# EasyEDA Pro project Battery_18650&3.eprj

# Schematic Schematic1_1
Board Name: Battery; Create Date: 2025-06-20; Page Name: P1; Project Name: Battery_18650&3; Schematic Name: Schematic1_1; Update Date: 2025-06-25; Company: 嘉立创EDA; Page Size: A4; Version: V1.0
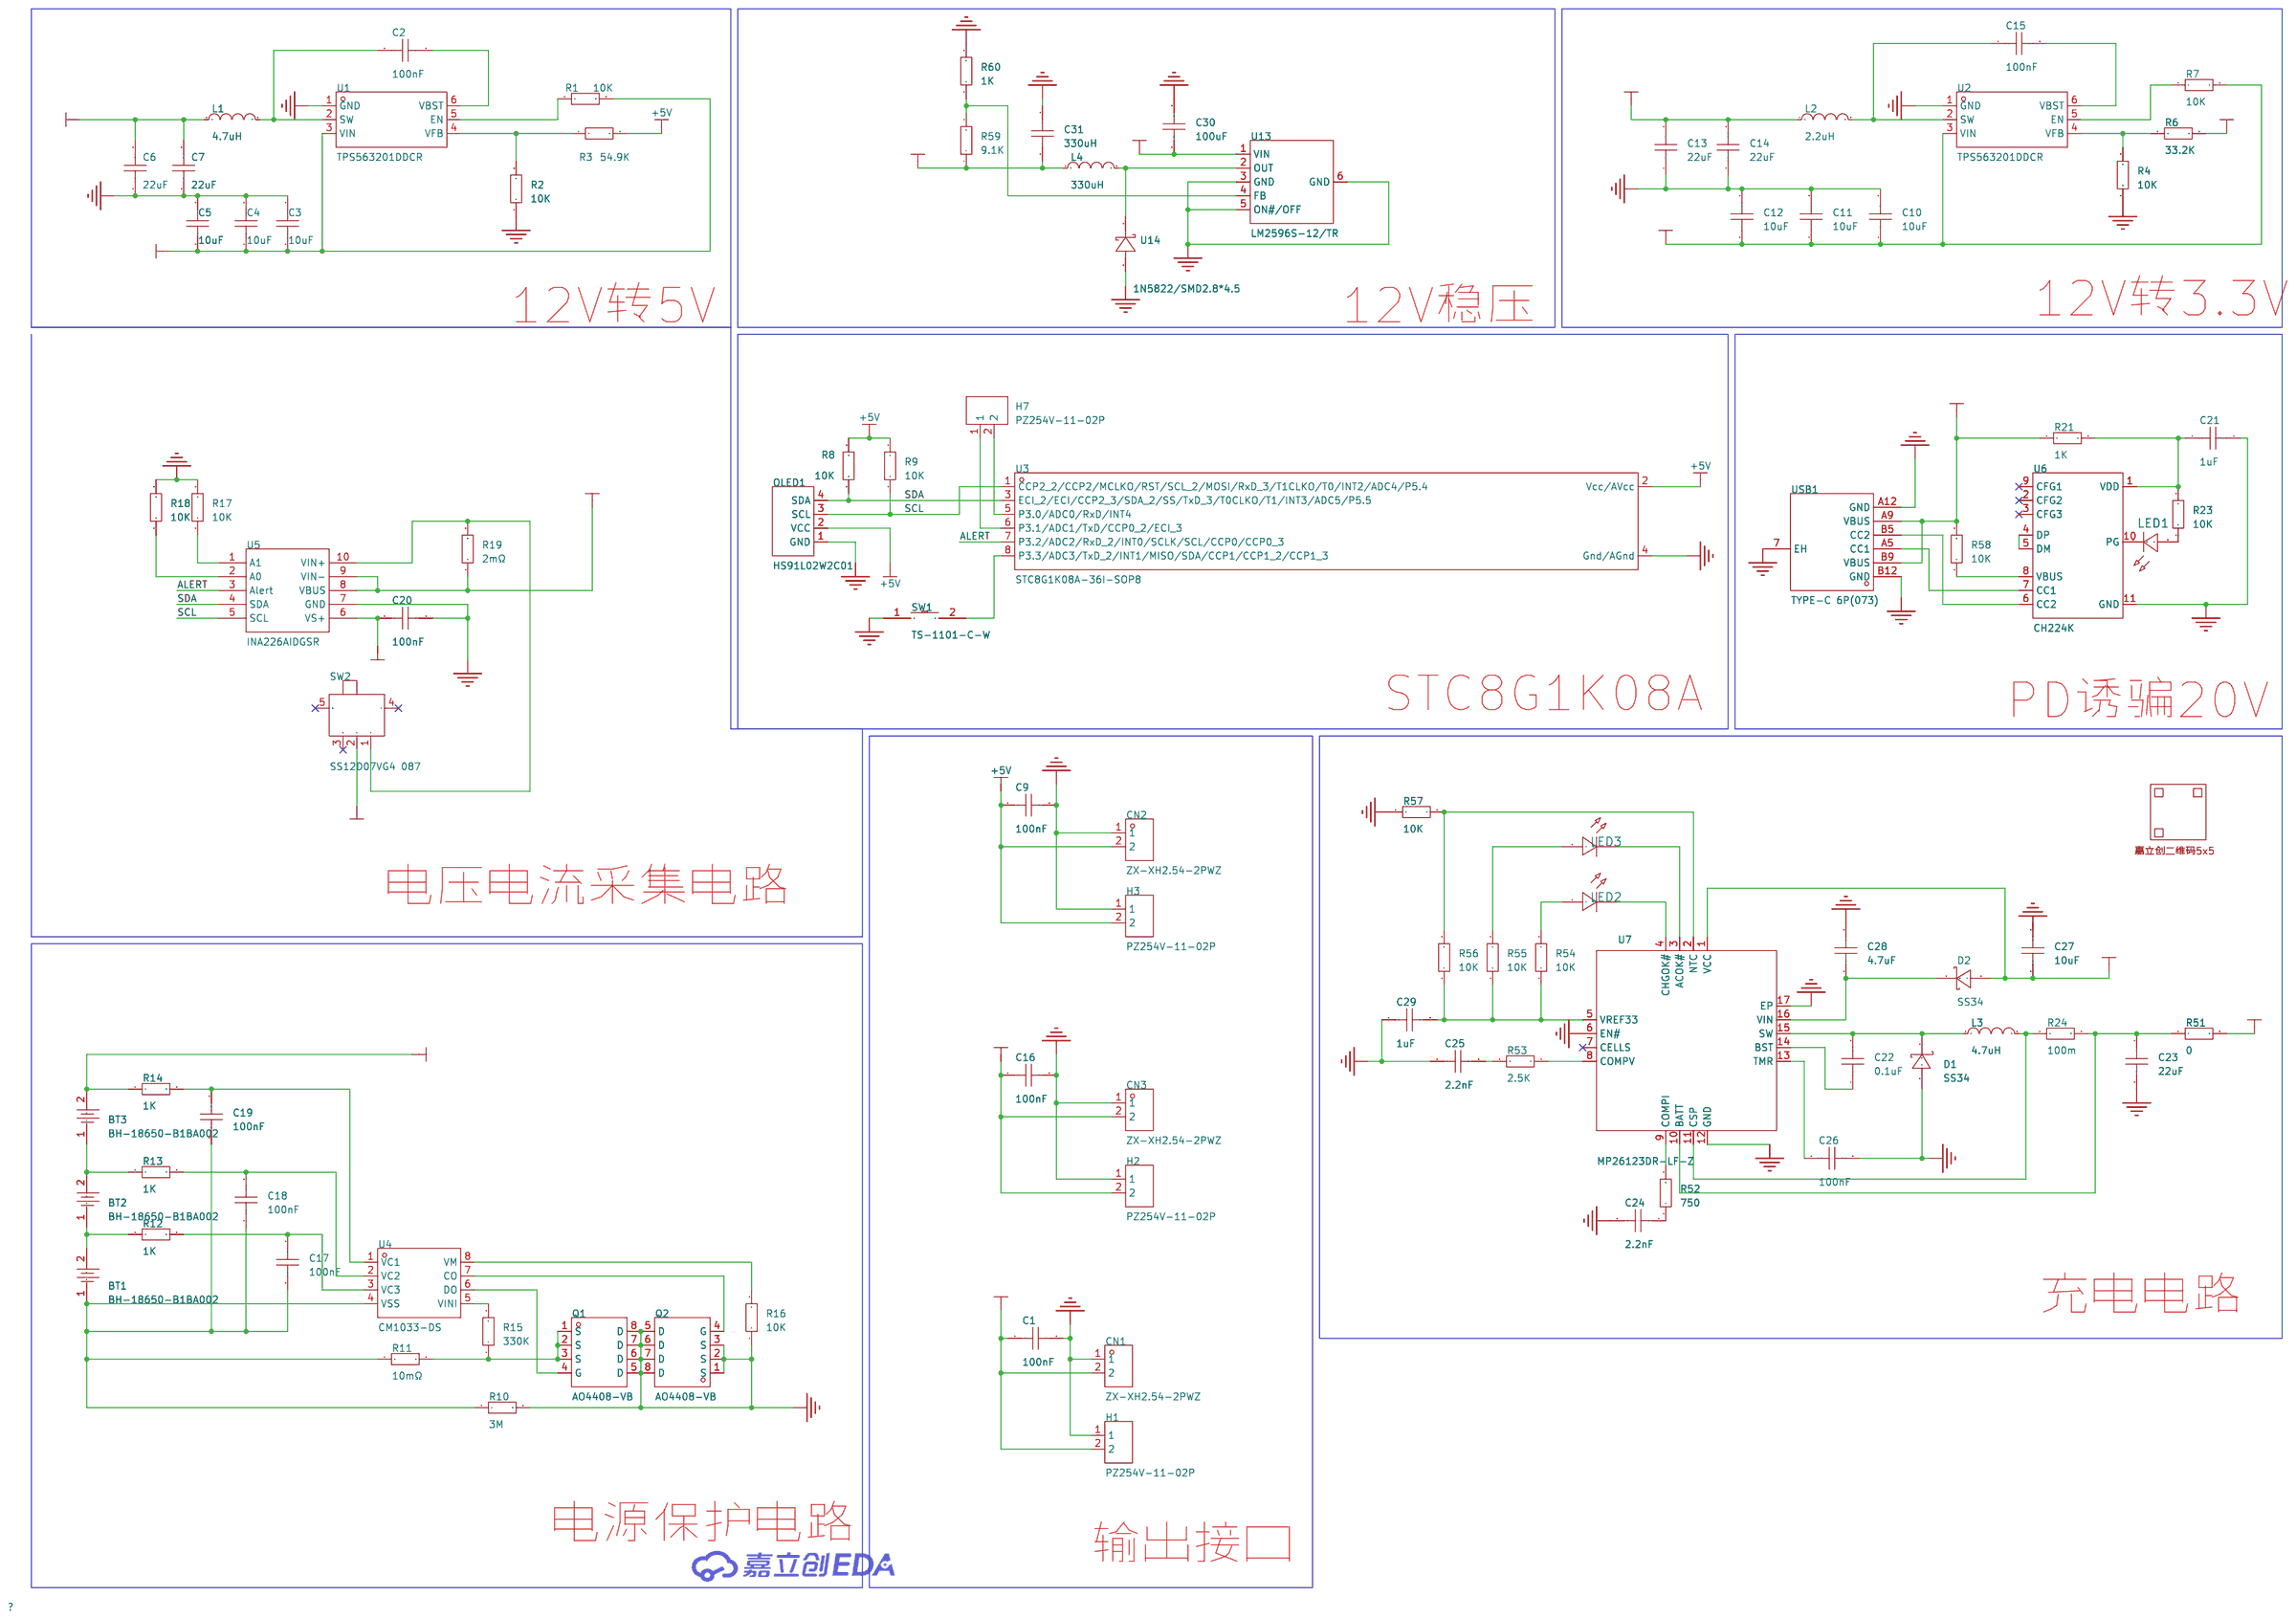
[diagram p0: schematic sheet]

## Parts
BT1  BH-18650-B1BA002  [BATTERY-SMD_18650-1S-L77.1-W20.7-1]
BT2  BH-18650-B1BA002  [BATTERY-SMD_18650-1S-L77.1-W20.7-1]
BT3  BH-18650-B1BA002  [BATTERY-SMD_18650-1S-L77.1-W20.7-1]
C1  100nF  [C0603]
C2  100nF  [C0603]
C3  10uF  [C0603]
C4  10uF  [C0603]
C5  10uF  [C0603]
C6  22uF  [C0603]
C7  22uF  [C0603]
C9  100nF  [C0603]
C10  10uF  [C0603]
C11  10uF  [C0603]
C12  10uF  [C0603]
C13  22uF  [C0603]
C14  22uF  [C0603]
C15  100nF  [C0603]
C16  100nF  [C0603]
C17  100nF  [C0603]
C18  100nF  [C0603]
C19  100nF  [C0603]
C20  100nF  [C0603]
C21  1uF  [C0603]
C22  0.1uF  [C0603]
C23  22uF  [C0603]
C24  2.2nF  [C0603]
C25  2.2nF  [C0603]
C26  100nF  [C0603]
C27  10uF  [C0603]
C28  4.7uF  [C0603]
C29  1uF  [C0603]
C30  100uF  [C0603]
C31  330uH  [C0603]
CN1  ZX-XH2.54-2PWZ  [CONN-TH_2P-P2.50_ZX-XH2.54-2PWZ]
CN2  ZX-XH2.54-2PWZ  [CONN-TH_2P-P2.50_ZX-XH2.54-2PWZ]
CN3  ZX-XH2.54-2PWZ  [CONN-TH_2P-P2.50_ZX-XH2.54-2PWZ]
D1  SS34  [SMC_L6.9-W5.9-LS7.9-RD]
D2  SS34  [SMC_L6.9-W5.9-LS7.9-RD]
H1  PZ254V-11-02P  [HDR-TH_2P-P2.54-V-M]
H2  PZ254V-11-02P  [HDR-TH_2P-P2.54-V-M]
H3  PZ254V-11-02P  [HDR-TH_2P-P2.54-V-M]
H7  PZ254V-11-02P  [HDR-TH_2P-P2.54-V-M]
L1  4.7uH  [IND-SMD_L4.0-W4.0_FNR40XXS]
L2  2.2uH  [IND-SMD_L4.0-W4.0_FNR40XXS]
L3  4.7uH  [IND-SMD_L11.5-W10.0_FXL1040]
L4  330uH  [IND-SMD_L11.5-W10.0_FXL1040]
LED1  -  [LED_0603]
LED2  -  [LED_0603]
LED3  -  [LED_0603]
OLED1  HS91L02W2C01  [OLED-TH_L38.0-W12.0_HS91L02W2C01]
Q1  AO4408-VB  [SO-8_L4.9-W3.9-P1.27-LS5.9-BL]
Q2  AO4408-VB  [SO-8_L4.9-W3.9-P1.27-LS5.9-BL]
R1  10K  [R0603]
R2  10K  [R0603]
R3  54.9K  [R0603]
R4  10K  [R0603]
R6  33.2K  [R0603]
R7  10K  [R0603]
R8  10K  [R0603]
R9  10K  [R0603]
R10  3M  [R0603]
R11  10mΩ  [R0603]
R12  1K  [R0603]
R13  1K  [R0603]
R14  1K  [R0603]
R15  330K  [R0603]
R16  10K  [R0603]
R17  10K  [R0603]
R18  10K  [R0603]
R19  2mΩ  [R0603]
R21  1K  [R0603]
R23  10K  [R0603]
R24  100m  [R0603]
R51  0  [R0603]
R52  750  [R0603]
R53  2.5K  [R0603]
R54  10K  [R0603]
R55  10K  [R0603]
R56  10K  [R0603]
R57  10K  [R0603]
R58  10K  [R0603]
R59  9.1K  [R0603]
R60  1K  [R0603]
SW1  TS-1101-C-W  [SW-SMD_L6.0-W3.3-LS8.0]
SW2  SS12D07VG4 087  [SW-TH_SS12D07VG4]
U1  TPS563201DDCR  [SOT-23-6_L2.9-W1.6-P0.95-LS2.8-BR]
U2  TPS563201DDCR  [SOT-23-6_L2.9-W1.6-P0.95-LS2.8-BR]
U3  STC8G1K08A-36I-SOP8  [SOP-8_L5.0-W4.0-P1.27-LS6.0-BL]
U4  CM1033-DS  [SOP-8_L5.0-W4.0-P1.27-LS6.2-BL]
U5  INA226AIDGSR  [MSOP-10_L3.0-W3.0-P0.50-LS5.0-BL]
U6  CH224K  [ESSOP-10_L4.9-W3.9-P1.0-LS6.0-TL-EP]
U7  MP26123DR-LF-Z  [QFN-16_L4.0-W4.0-P0.65-BL-EP2.2]
U13  LM2596S-12/TR  [TO-263-5_L10.6-W9.6-P1.70-LS15.9-BR]
U14  1N5822/SMD2.8*4.5  [DO-214AC_L4.3-W2.7-LS5.0-RD]
U24  -  [JLC-QRCODE-5x5]
USB1  TYPE-C 6P(073)  [TYPE-C-SMD_TYPE-C-6P_5]

## Library data of the parts
BT1-BT3 = BH-18650-B1BA002: 连接器类型:电池盒;适用电池规格:18650;; LCSC Part Name: 电池盒 适用电池:18650; Supplier Part: C2988620; Manufacturer: MYOUNG(美阳); Supplier Footprint: SMD; JLCPCB Part Class: 扩展库; Datasheet: https://atta.szlcsc.com/upload/public/pdf/source/20220402/870DB99AB50CA0DF8D51CF7C86A51FAB.pdf; Supplier: LCSC; Connector Type: 电池盒; Battery Type: 18650
C1-C7 C9-C31 = CAP_0603: Supplier Footprint: 0603
CN1-CN3 = ZX-XH2.54-2PWZ: 插针结构:1x2P;间距:2.5mm;安装方式:弯插;参考系列:XH;总PIN数:2P;排数:1;每排PIN数:2;行距:-;额定电流:3A;触头材质:黄铜;触头镀层:锡;工作温度范围:-25℃~+85℃;; LCSC Part Name: 1x2P 间距:2.5mm 弯插 系列:XH; Supplier Part: C7429641; Manufacturer: Megastar(兆星); Supplier Footprint: 弯插,P=2.5mm; JLCPCB Part Class: 扩展库; Datasheet: https://atta.szlcsc.com/upload/public/pdf/source/20230619/56AE8F2E01CDFEAA97FC89B5ED558AB5.pdf; Supplier: LCSC; Pins Structure: 1x2P; Pitch: 2.5mm; Mounting Type: 弯插; Reference Series: XH; Number of Pins: 2P; Number of Rows: 1; Number of PINs Per Row: 2; Rated Current: 3A; Contact Material: 黄铜; Contact Plating: 锡; Operating Temperature: -25℃~+85℃; Rated Voltage (Max): 250V; Plastic Material: PA66; Flame Retardant Rating: UL94V-0; Color: 白色; Z-Height of the Board: 5.9mm; X-Length of Bottom Edge on Board (Spacing Line): 7.5mm; Y-Width of Bottom Edge on Board: 7.32mm
D1 D2 = SS34_C154551: 正向压降(Vf):500mV@3A;直流反向耐压(Vr):40V;平均整流电流(Io):3A;; LCSC Part Name: 电压:40V 电流:3A; Supplier Part: C154551; Manufacturer: onsemi(安森美); Supplier Footprint: SMC(DO-214AB); JLCPCB Part Class: 扩展库; Datasheet: https://atta.szlcsc.com/upload/public/pdf/source/20230523/C977B907190B075B30FD168351032A84.pdf; Supplier: LCSC; Forward Voltage (Vf@If): 500mV@3A; Reverse Voltage (Vr): 40V; Average Rectified Current (Io): 3A; Reverse Leakage Current (Ir): 500uA@40V
H1-H3 H7 = PZ254V-11-02P: 插针结构:1x2P;间距:2.54mm;行距:-;圆针/方针:方针;安装方式:直插;排数:单排;总PIN位数:2P;额定电流:-;额定电压:-;配合针长度:6mm;塑高:2.5mm;端接针长度:3mm;触头材质:黄铜;触头镀层:-;工作温度:-40℃~+105℃;颜色:黑色;; LCSC Part Name: 1x2P 间距:2.54mm 方针 直插; Supplier Part: C492401; Manufacturer: XFCN(兴飞); Supplier Footprint: 插件,P=2.54mm; JLCPCB Part Class: 扩展库; Datasheet: https://atta.szlcsc.com/upload/public/pdf/source/20200309/C492401_A812433581A9B211A7FFA413ADDFF0E5.pdf; Supplier: LCSC; Pin Structure: 1x2P; Pitch: 2.54mm; Circluar Pins/Square Pins: 方针; Mounting Type: 直插; Number of Rows: 单排; Number of Pins: 2P; Length of Mating Pin: 6mm; Insulation Height: 2.5mm; Length of End Connection Pin: 3mm; Contact Material: 黄铜; Operating Temperature: -40℃~+105℃; Color: 黑色
L1 L2 = FNR4030S4R7MT: 电感值:4.7uH;精度:±20%;额定电流:2.3A;饱和电流(Isat):3.2A;类型:磁胶屏蔽绕线合金电感;; LCSC Part Name: 4.7uH ±20% 3.2A; Supplier Part: C167874; Manufacturer: cjiang(长江微电); Supplier Footprint: SMD,4x4mm; JLCPCB Part Class: 扩展库; Datasheet: https://atta.szlcsc.com/upload/public/pdf/source/20190327/C167925_9EFF0AABC4CA629C2CC95961DBF7D39D.pdf; Supplier: LCSC; Tolerance: ±20%; Current Rating: 2.3A; Current - Saturation(Isat): 3.2A; DC Resistance(DCR): 78mΩ; Type: 磁胶屏蔽绕线合金电感
L3 L4 = FXL1040-4R7-M: 电感值:4.7uH;精度:±20%;额定电流:9A;饱和电流(Isat):15A;类型:一体成型电感;; LCSC Part Name: 4.7uH ±20% 15A; Supplier Part: C167230; Manufacturer: cjiang(长江微电); Supplier Footprint: SMD,11.5x10mm; JLCPCB Part Class: 扩展库; Datasheet: https://atta.szlcsc.com/upload/public/pdf/source/20240426/3189EA8206330E2108542F9E34E540E7.pdf; Supplier: LCSC; Tolerance: ±20%; Rated Current: 9A; Saturation Current (Isat): 15A; DC Resistance (DCR): 20mΩ; Type: 一体成型电感
LED1-LED3 = LED_0603-R: Supplier Footprint: 0603
OLED1 = HS91L02W2C01: 主控芯片:SSD1306;接口类型:I2C;尺寸(inch):0.91;像素分辨率:128x32;; LCSC Part Name: 0.91寸OLED显示屏白光IIC; Supplier Part: C5248081; Manufacturer: HS(汉昇); JLCPCB Part Class: 扩展库; Datasheet: https://atta.szlcsc.com/upload/public/pdf/source/20230727/C3E43C8E3DDA847F5681FEE7D95C153D.pdf; Supplier: LCSC; Main Control Chip: SSD1306; Interface Type: I2C; Size: 0.91; Pixel Resolution: 128x32; Operating Temperature: -40℃~+70℃
Q1 Q2 = AO4408-VB: 类型:1个N沟道;漏源电压(Vdss):20V;连续漏极电流(Id):13A;导通电阻(RDS(on)@Vgs,Id):-;功率:2.2W;阈值电压(Vgs(th)@Id):1V@250uA;; LCSC Part Name: 1个N沟道 耐压:20V 电流:13A; Supplier Part: C709888; Manufacturer: VBsemi(微碧半导体); Supplier Footprint: SO-8; JLCPCB Part Class: 扩展库; Datasheet: https://atta.szlcsc.com/upload/public/pdf/source/20240805/9146D5414562EF1B99E92FE9649BFADF.pdf; Supplier: LCSC; Type: 1个N沟道; Drain Source Voltage (Vdss): 20V; Continuous Drain Current (Id): 13A; Power Dissipation (Pd): 2.2W; Gate Threshold Voltage (Vgs(th)@Id): 1V@250uA; Total Gate Charge (Qg@Vgs): 6.8nC@5V; Input Capacitance (Ciss@Vds): 800pF@15V; Reverse Transfer Capacitance (Crss@Vds): 73pF@15V; Operating Temperature: -55℃~+150℃@(Tj)
R1-R4 R6-R19 R21 R23 R24 R51-R60 = Res_0603: Supplier Footprint: 0603
SW1 = TS-1101-C-W: 电路结构:单刀单掷;按钮形状:矩形按钮;作用力:260gf;安装方式:立贴;开关长度:6mm;开关宽度:3.6mm;开关高度:2.5mm;带支架:不带;触点电流:50mA;额定电压(AC):-;额定电压(DC):12V;额定功率:-;绝缘电阻:-;带灯:无;机械寿命:5万次;; LCSC Part Name: 6*3.6*2.5mm 立贴 轻触开关; Supplier Part: C318938; Manufacturer: XKB Connectivity(中国星坤); Supplier Footprint: SMD; JLCPCB Part Class: 扩展库; Datasheet: https://atta.szlcsc.com/upload/public/pdf/source/20200227/C318938_C2E53B1EEDE37D980A33616AC086DE53.pdf; Supplier: LCSC; Circuit: 单刀单掷; Actuator Style: 矩形按钮; Operating Force: 260gf; Mounting Style: 立贴; Switch Length: 6mm; Switch Width: 3.6mm; Switch Height: 2.5mm; Strike Gundam: 不带; Contact Current: 50mA; Voltage Rating (DC): 12V; Actuator/Cap Color: 白色带淡绿; With Lamp: 无; Mechanical Life: 5万次; Operating Temperature: -30℃~+85℃
SW2 = SS12D07VG4 087: 电路结构:单刀双掷;安装方式:直插;开关颜色:-;额定电流(DC):500mA;额定电压(DC):50V;额定电流(AC):-;额定电压(AC):-;机械寿命:5千次;; Supplier Part: C2939726; Manufacturer: SHOU HAN(首韩); Supplier Footprint: 插件; JLCPCB Part Class: 扩展库; Datasheet: https://atta.szlcsc.com/upload/public/pdf/source/20220106/E715996F66241B9FD900079FF66489BE.pdf; Supplier: LCSC; Circuit: 单刀双掷; Pin Style: PC引脚; Switch Length: 8.7mm; Switch Width: 4.4mm; Switch Height: 4.7mm; Mounting Style: 直插; Current Rating (DC): 500mA; Voltage Rating (DC): 50V; Mechanical Life: 5千次; Operating Temperature: -10℃~+50℃
U1 U2 = TPS563201DDCR: 功能类型:降压型;输出类型:可调;工作电压:4.5V~17V;输出电压:768mV~7V;输出电流:3A;; LCSC Part Name: 4.5V至17V输入，3A同步降压电压调节器; Supplier Part: C116592; Manufacturer: TI(德州仪器); Supplier Footprint: SOT-23-THIN-6; JLCPCB Part Class: 扩展库; Datasheet: https://atta.szlcsc.com/upload/public/pdf/source/20230424/FEEFD13F14AFA838E4C009B2DDC1DFA0.pdf; Supplier: LCSC; Function: 降压型; Output Type: 可调; Input Voltage: 4.5V~17V; Output Voltage: 768mV~7V; Output Current: 3A; Switching Frequency: 580kHz; Operating Temperature: -40℃~+125℃@(TJ); Synchronous Rectification: 是; Number of Outputs: 1; Topology: 降压式; Switch tube (built-in/external): 内置
U3 = STC8G1K08A-36I-SOP8: CPU内核:51系列;应用领域:-;; Supplier Part: C915663; Manufacturer: STC; Supplier Footprint: SOP-8; JLCPCB Part Class: 扩展库; Datasheet: https://atta.szlcsc.com/upload/public/pdf/source/20241226/1556D7EB67C0BC8C1661C3E278549CA4.pdf; Supplier: LCSC; CPU Core: 51系列; Program Storage Size: 8KB; Program Memory Type: FLASH; Number of I/O: 6; ADC (Bit): 10bit; Low Voltage Detection Threshold: 1.9V~5.5V
U4 = CM1033-DS: LCSC Part Name: 多节保护IC; Supplier Part: C2685513; Manufacturer: iCM(创芯微); Supplier Footprint: SOP-8; JLCPCB Part Class: 扩展库; Datasheet: https://atta.szlcsc.com/upload/public/pdf/source/20210126/C2685513_8F32148B0162AFCF3EA5BF6A8D91D8BC.pdf; Supplier: LCSC
U5 = INA226AIDGSR: 放大器数:-;共模电压:300mV~40V;增益:-;带宽:-;; Supplier Part: C49851; Manufacturer: TI(德州仪器); Supplier Footprint: MSOP-10; JLCPCB Part Class: 扩展库; Datasheet: https://atta.szlcsc.com/upload/public/pdf/source/20231204/F50A9EB86BE78FEA83E070C913617774.pdf; Supplier: LCSC; Vcm - Common Mode Voltage: 300mV~40V; Voltage - Supply: 2.7V~5.5V; Operating Temperature: -40℃~+125℃
U6 = CH224K: LCSC Part Name: USBPD等多快充协议受电芯片CH224; Supplier Part: C970725; Manufacturer: WCH(南京沁恒); Supplier Footprint: ESSOP-10-150mil-1mm; JLCPCB Part Class: 扩展库; Datasheet: https://atta.szlcsc.com/upload/public/pdf/source/20240313/43C2AFDDBDD1F65B60386D2CCAB0811B.pdf; Supplier: LCSC
U7 = MP26123DR-LF-Z: 电源电压:24V;最大充电电流:2A;电池类型:锂离子/聚合物;电池节数:2~3;; Supplier Part: C110399; Manufacturer: MPS(芯源); Supplier Footprint: QFN-16-EP(4x4); JLCPCB Part Class: 扩展库; Datasheet: https://atta.szlcsc.com/upload/public/pdf/source/20240311/7FFC6AEB8FB864187C6EEFC1B32C9471.pdf; Supplier: LCSC; Supply Voltage: 24V; Maximum Charge Current: 2A; Type of Battery: 锂离子/聚合物; Number of Cells: 2~3; Operating Temperature: -40℃~+85℃
U13 = LM2596S-12/TR_C462059: 功能类型:降压型;工作电压:4.5V~40V;输出电压:11.52V~12.48V;输出电流:3A;; Supplier Part: C462059; Manufacturer: HGC(华冠); Supplier Footprint: TO-263-5; JLCPCB Part Class: 扩展库; Datasheet: https://atta.szlcsc.com/upload/public/pdf/source/20210419/C340930_48163ADD0F81828319BE481FCEEE6929.pdf; Supplier: LCSC; Function: 降压型; Voltage - Supply: 4.5V~40V; Output Voltage: 11.52V~12.48V; Output Current: 3A; Frequency - Switching: 150kHz; Operating Temperature: -40℃~+125℃; Number of Outputs: 1; Quiescent Current: 10mA; Switch tube (built-in/external): 内置
U14 = 1N5822/SMD2.8*4.5: Supplier Part: C9900015672; Supplier Footprint: DO-214AC; JLCPCB Part Class: 扩展库; Supplier: LCSC
U24 = 嘉立创二维码5x5
USB1 = TYPE-C 6P(073): 连接器类型:Type-C;标准:USB 3.1;公母:母;安装方式:卧贴;触点数量:6P;端口数量:1;额定电流 - 电源:3A;工作温度范围:-25℃~+85℃;; LCSC Part Name: Type-C 母 卧贴; Supplier Part: C668623; Manufacturer: SHOU HAN(首韩); Supplier Footprint: SMD; JLCPCB Part Class: 扩展库; Datasheet: https://atta.szlcsc.com/upload/public/pdf/source/20200618/C668623_A4B260DED7AC1949BAC6AE39E9F4CD80.pdf; Supplier: LCSC; Connector Type: Type-C; Standard: USB 3.1; Gender: 母; Mounting Style: 卧贴; Number of Contacts: 6P; Number of Ports: 1; Current Rating - Power (Max): 3A; Operating Temperature Range: -25℃~+85℃; Rated Voltage (Max): 5V; Connect-Disconnect Life: 1万次; Core Colour: 黑色

## Nets
12V: C1.1 C31.1 CN1.2 H1.2 L4.1 R59.1
+3.3V: C13.2 C14.2 C16.1 C20.1 CN3.2 H2.2 L2.1 R6.2 U5.6(VS+)
+5V: C6.2 C7.2 C9.1 CN2.2 H3.2 L1.1 OLED1.2(VCC) R3.2 R8.2 R9.1 U3.2(Vcc/AVcc)
GND: C1.2 C3.2 C4.2 C5.2 C6.1 C7.1 C9.2 C10.2 C11.2 C12.2 C13.1 C14.1 C16.2 C20.2 C21.2 C23.2 C24.2 C25.1 C26.2 C27.2 C28.2 C29.1 C30.2 C31.2 CN1.1 CN2.1 CN3.1 D1.2(A) H1.1 H2.1 H3.1 OLED1.1(GND) Q1.5(D) Q1.6(D) Q1.7(D) Q1.8(D) Q2.1(S) Q2.2(S) Q2.3(S) Q2.5(D) Q2.6(D) Q2.7(D) Q2.8(D) R2.1 R4.1 R10.2 R16.1 R17.2 R18.2 R57.2 R60.2 SW1.1 U1.1(GND) U2.1(GND) U3.4(Gnd/AGnd) U5.7(GND) U6.11(GND) U7.6(EN#) U7.12(GND) U7.17(EP) U13.3(GND) U13.5(ON#/OFF) U13.6(GND) U14.2(K) USB1.7(EH) USB1.A12(GND) USB1.B12(GND)
VBAT: C3.1 C4.1 C5.1 C10.1 C11.1 C12.1 C30.1 R1.2 R7.2 R19.1 R51.2 U1.3(VIN) U2.3(VIN) U5.8(VBUS) U5.9(VIN-) U13.1(VIN)
VBAT+5V: BT3.2 R14.1 SW2.2
VBUS: C27.1 D2.2(A) R21.1 R58.2 U7.1(VCC) USB1.A9(VBUS) USB1.B9(VBUS)
ALERT: U3.7(P3.2/ADC2/RxD_2/INT0/SCLK/SCL/CCP0/CCP0_3) U5.3(Alert)
SCL: OLED1.3(SCL) R9.2 U3.1(CCP2_2/CCP2/MCLKO/RST/SCL_2/MOSI/RxD_3/T1CLKO/T0/INT2/ADC4/P5.4) U5.5(SCL)
SDA: OLED1.4(SDA) R8.1 U3.3(ECI_2/ECI/CCP2_3/SDA_2/SS/TxD_3/T0CLKO/T1/INT3/ADC5/P5.5) U5.4(SDA)
$1N480: C2.2 U1.6(VBST)
$1N907: R1.1 U1.5(EN)
$1N1663: C2.1 L1.2 U1.2(SW)
$1N2394: C15.1 L2.2 U2.2(SW)
$1N2430: C15.2 U2.6(VBST)
$1N2495: R4.2 R6.1 U2.4(VFB)
$1N2733: R2.2 R3.1 U1.4(VFB)
$1N2737: R7.1 U2.5(EN)
$1N3211: SW1.2 U3.8(P3.3/ADC3/TxD_2/INT1/MISO/SDA/CCP1/CCP1_2/CCP1_3)
$1N3646: H7.2 U3.5(P3.0/ADC0/RxD/INT4)
$1N3651: H7.1 U3.6(P3.1/ADC1/TxD/CCP0_2/ECI_3)
$1N4805: BT2.2 BT3.1 R13.1
$1N4809: BT1.2 BT2.1 R12.1
$1N4814: BT1.1 C17.1 C18.1 C19.1 R10.1 R11.1 U4.4(VSS)
$1N5216: C17.2 R12.2 U4.3(VC3)
$1N5255: C18.2 R13.2 U4.2(VC2)
$1N5318: C19.2 R14.2 U4.1(VC1)
$1N5612: R15.2 U4.5(VINI)
$1N5633: Q1.1(S) Q1.2(S) Q1.3(S) R11.2 R15.1
$1N5753: Q1.4(G) U4.6(DO)
$1N5763: Q2.4(G) U4.7(CO)
$1N5768: R16.2 U4.8(VM)
$1N6297: R17.1 U5.1(A1)
$1N6302: R18.1 U5.2(A0)
$1N6419: R19.2 SW2.1 U5.10(VIN+)
$1N6945: U6.4(DP) U6.5(DM)
$1N7077: C21.1 R21.2 R23.2 U6.1(VDD)
$1N7476: LED1.1(C) U6.10(PG)
$1N7478: LED1.2(A) R23.1
$1N7673: C22.2 D1.1(C) L3.1 U7.15(SW)
$1N7677: C22.1 U7.14(BST)
$1N7885: C23.1 R24.2 R51.1 U7.10(BATT)
$1N8045: R52.2 U7.9(COMPI)
$1N8238: R53.2 U7.8(COMPV)
$1N8288: C25.2 R53.1
$1N8361: C26.1 U7.13(TMR)
$1N8485: C28.1 D2.1(C) U7.16(VIN)
$1N8636: C29.2 R54.1 R55.1 R56.1 U7.5(VREF33)
$1N8748: LED2.2(A) R54.2
$1N8803: LED2.1(C) U7.4(CHGOK#)
$1N8881: LED3.2(A) R55.2
$1N8936: LED3.1(C) U7.3(ACOK#)
$1N8991: R56.2 R57.1 U7.2(NTC)
$1N9197: L3.2 R24.1 U7.11(CSP)
$1N9446: U6.7(CC1) USB1.A5(CC1)
$1N9462: U6.6(CC2) USB1.B5(CC2)
$1N9510: R58.1 U6.8(VBUS)
$1N10062: C24.1 R52.1
$1N12058: L4.2 U13.2(OUT) U14.1(A)
$1N12301: R59.2 R60.1 U13.4(FB)

Not connected (* = marked no-connect by the designer): SW2 3* 4* 5*; U6 2(CFG2)* 3(CFG3)* 9(CFG1)*; U7 7(CELLS)*

## Notes on the sheet
- 12V转5V
- 12V稳压
- 12V转3.3V
- STC8G1K08A
- PD诱骗20V
- 电压电流采集电路
- 充电电路
- 电源保护电路
- 输出接口

# Board PCB1_1
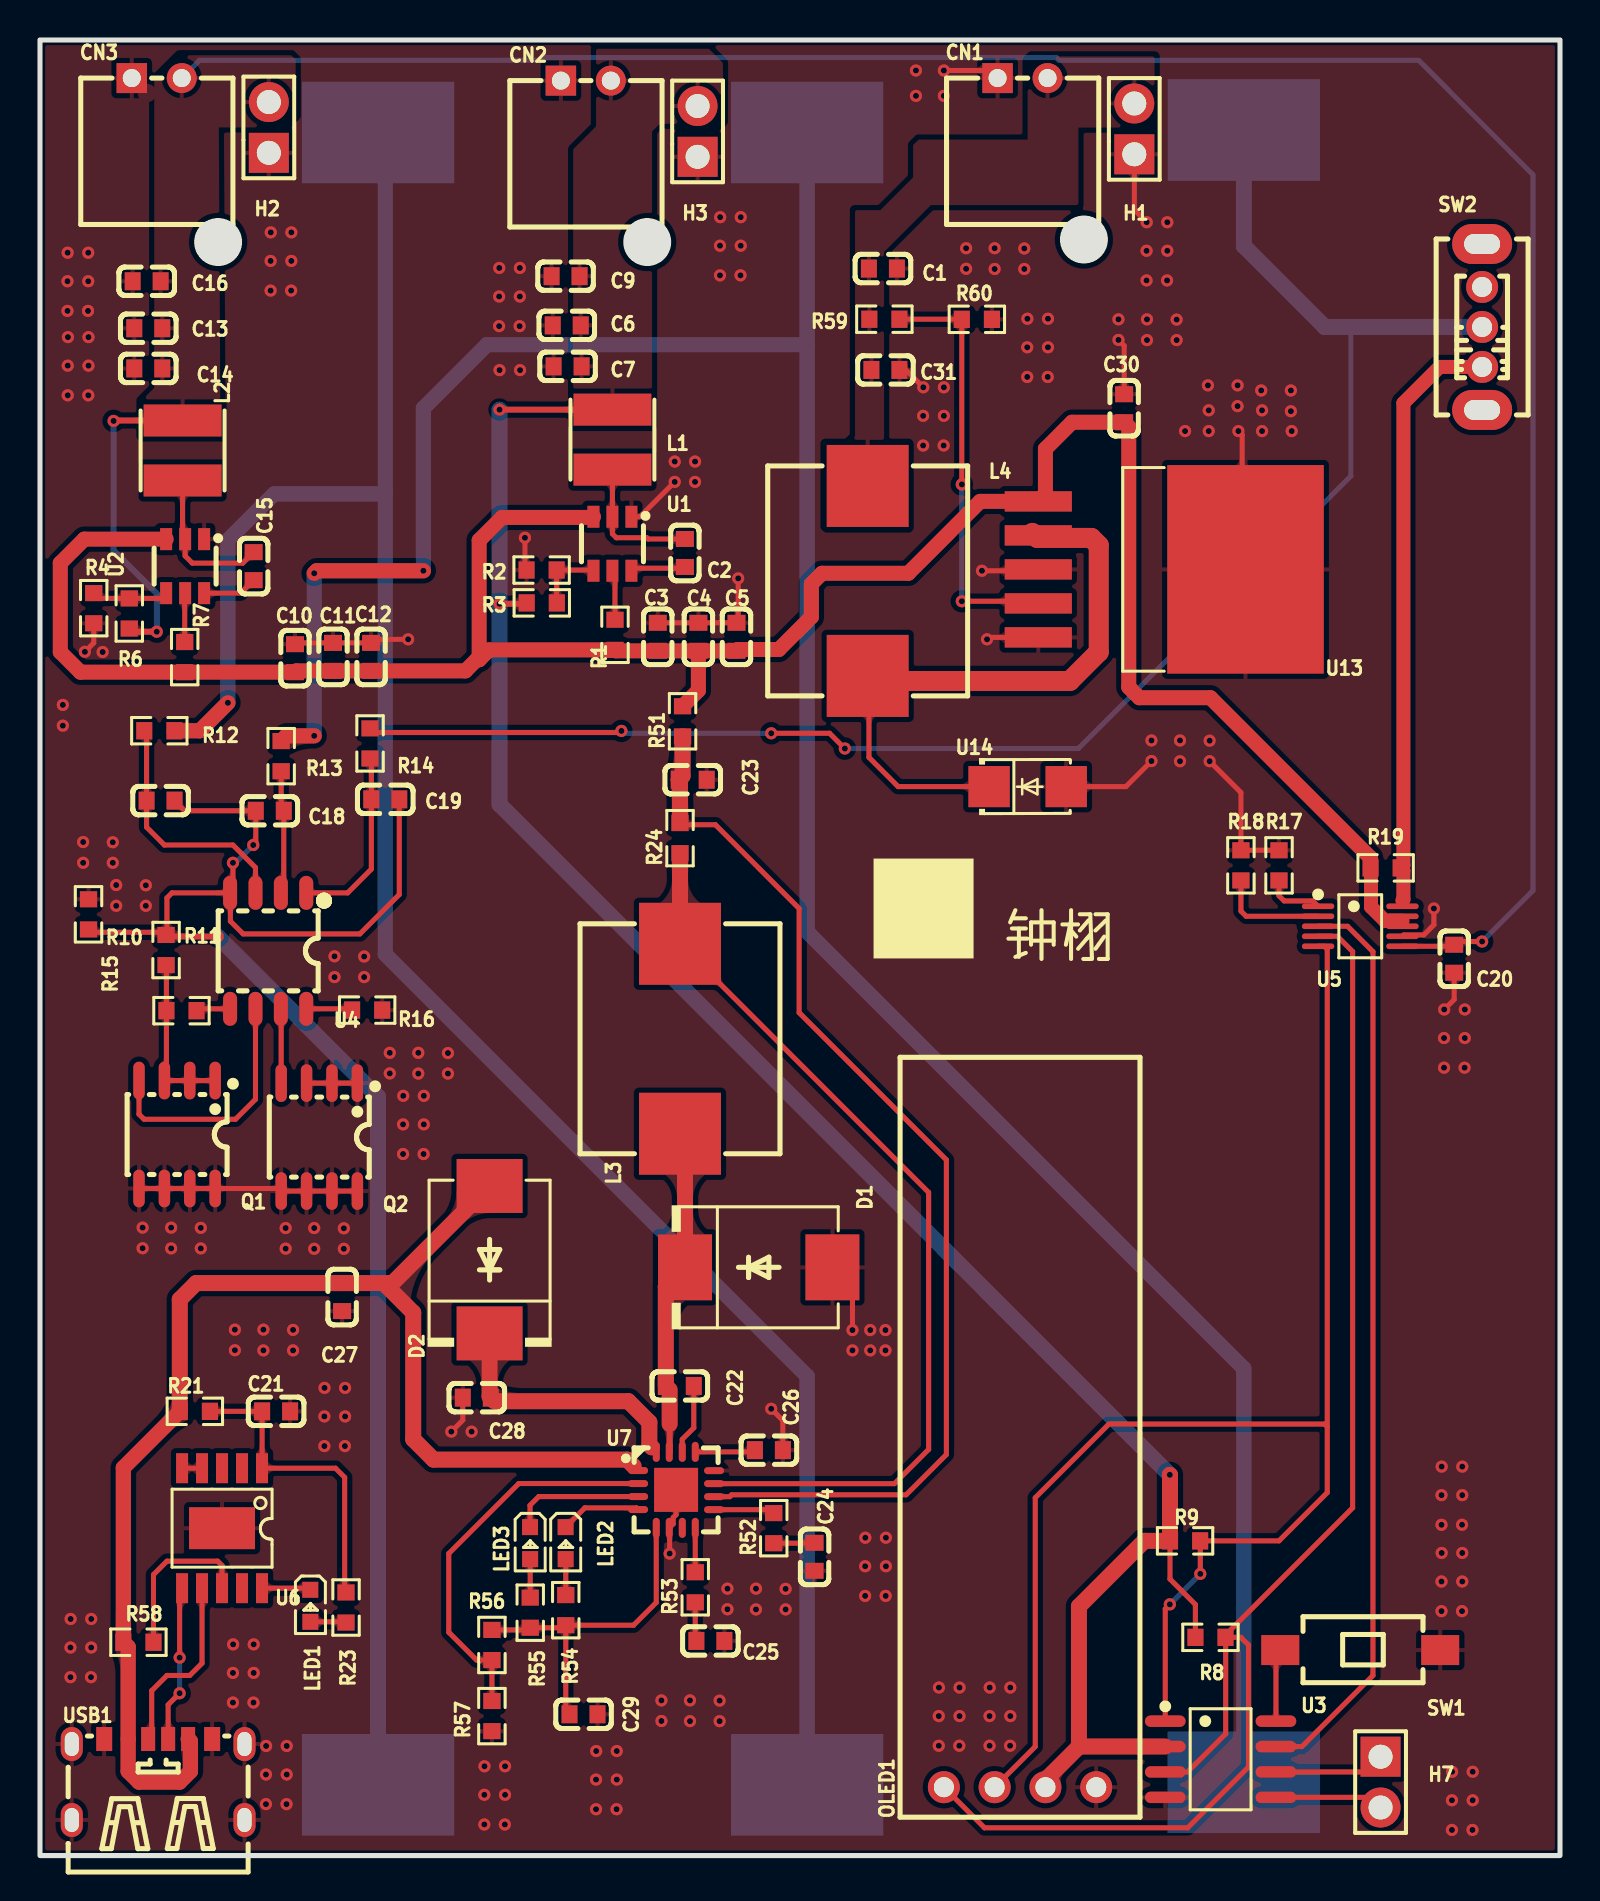
[diagram p1: board, top side]
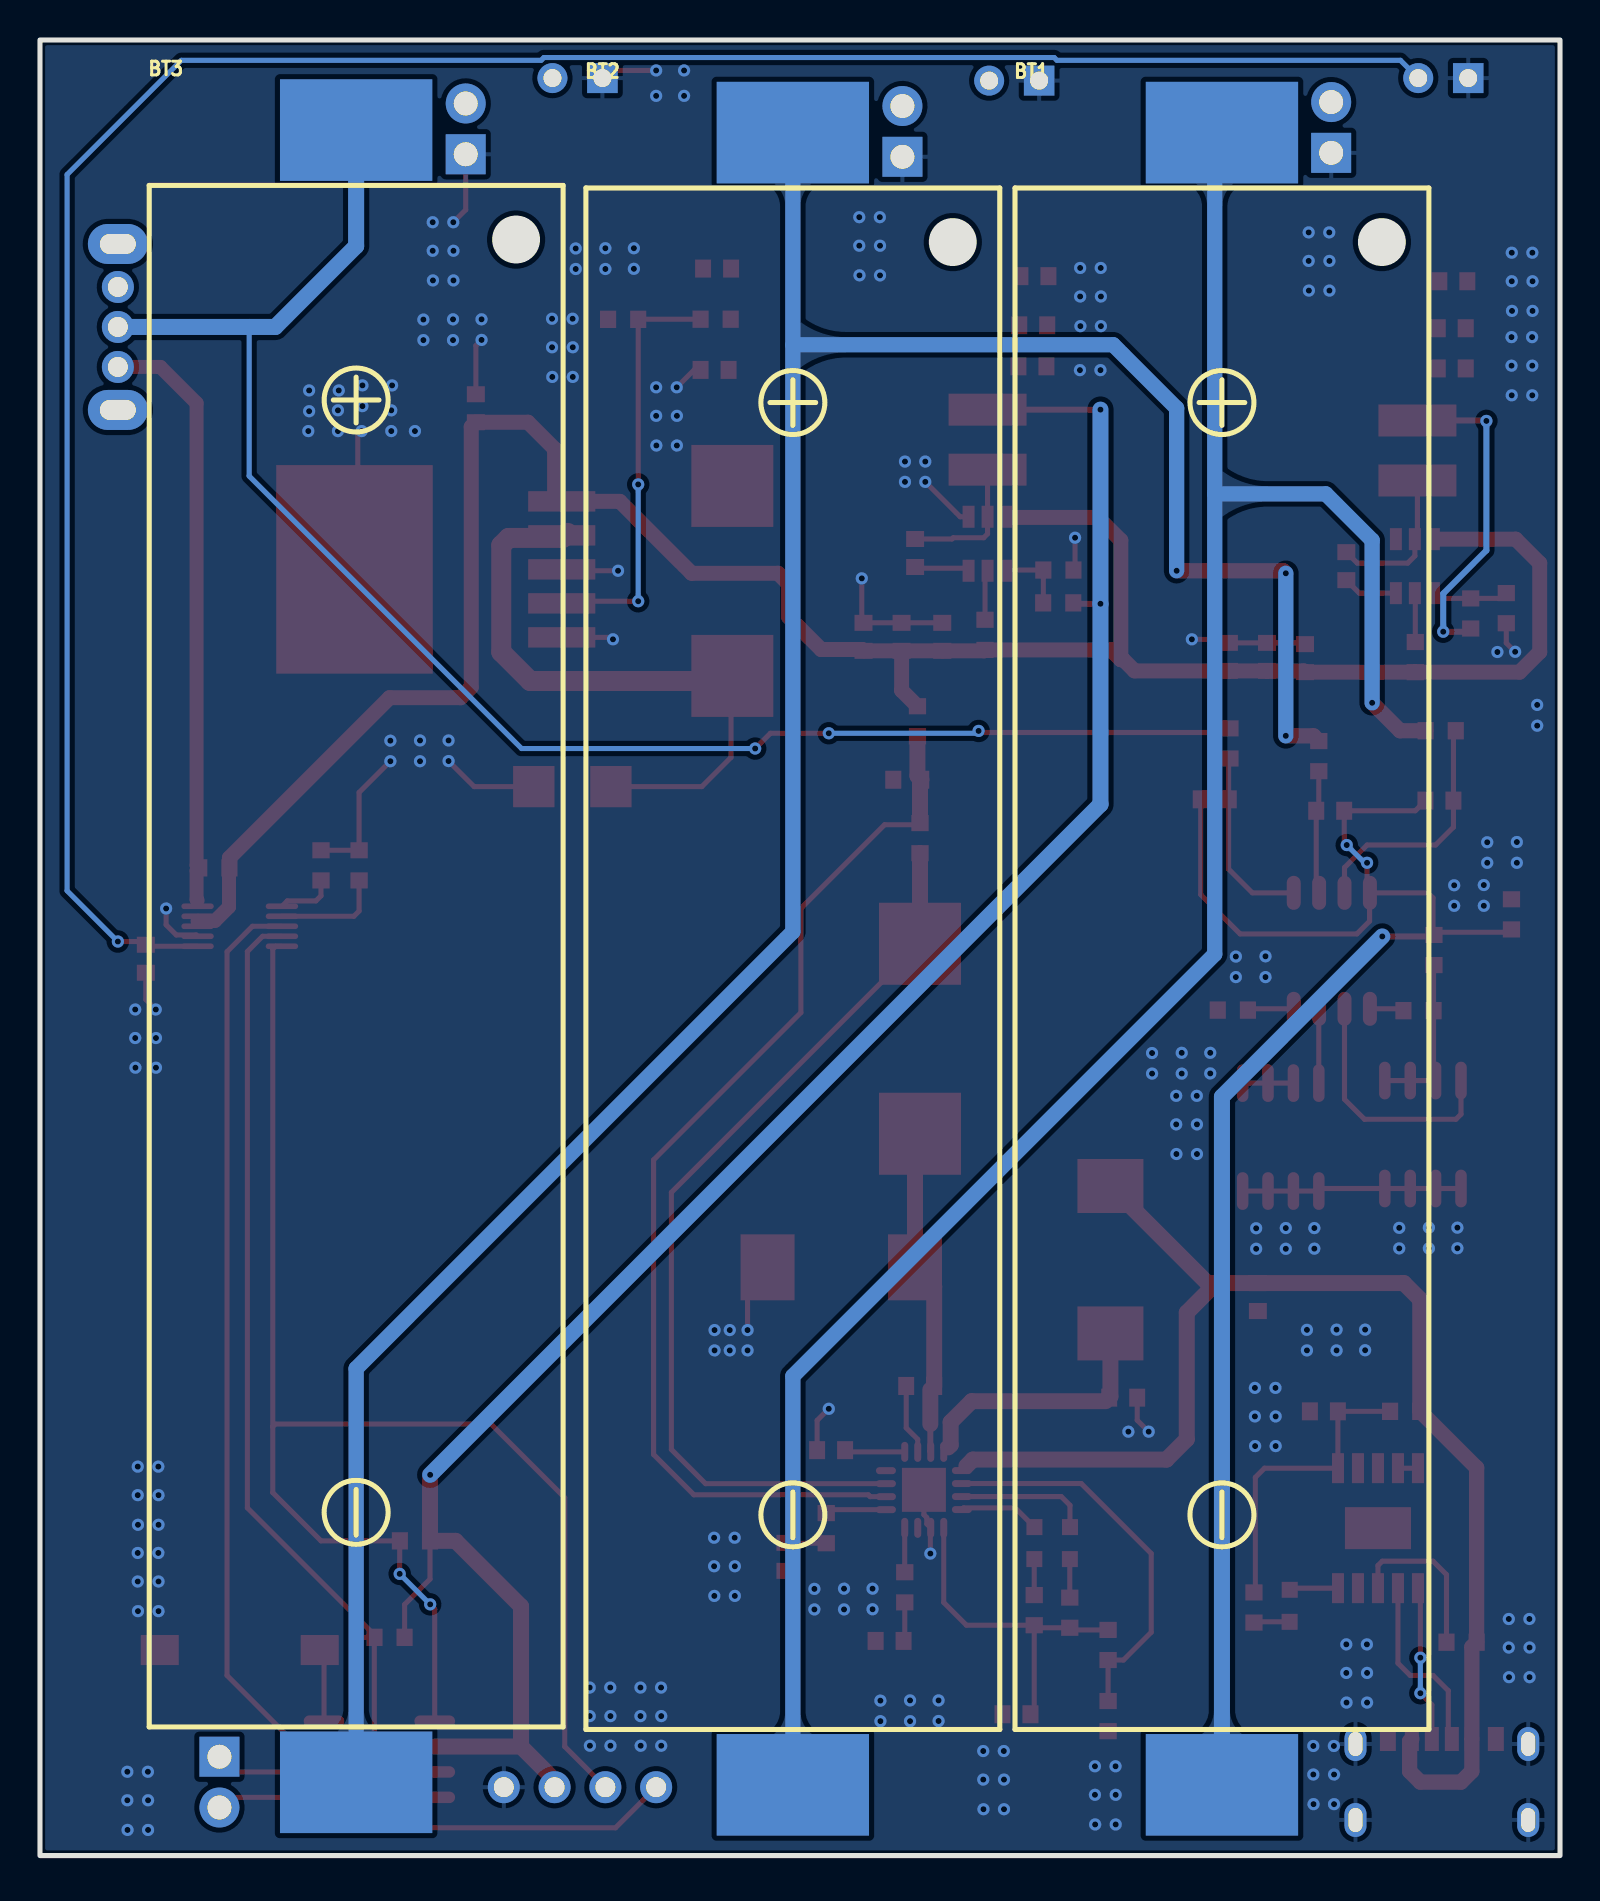
[diagram p2: board, bottom side, seen from below]

Outline 76.03 x 90.8 mm; copper layers: Top Layer, Bottom Layer. Coordinates in mm from the lower left corner of the outline.
Outline path: rectangle 0,90.8 76.03,0
Stack: Top Layer 0.035mm / Dielectric1 1.51mm FR4 er 4.5 / Bottom Layer 0.035mm

## Design rules (mm)
template: JLCPCB Capability(Two Layers Board)
spacing copperThickness1oz (default): track to track 0.102, other pairs 0.152 to 0.3
spacing copperThickness2oz: track to track 0.203, other pairs 0.152 to 0.3
track width copperThickness1oz (default): min 0.127, default 0.254, max 2.54
track width copperThickness2oz: min 0.203, default 0.254, max 2.54
differential pair differentialPair (default): width min 0.127, default 0.254, max 2.54; gap min 0.152, default 0.152
via viaSize (default): diameter min 0.5, default 0.61, max 10; hole min 0.3, default 0.305, max 6.3

## Placement (name value [footprint] x y rotation side)
BT1  BH-18650-B1BA002  [BATTERY-SMD_18650-1S-L77.1-W20.7-1]  16.91 44.85 180 bottom
BT2  BH-18650-B1BA002  [BATTERY-SMD_18650-1S-L77.1-W20.7-1]  38.37 44.85 180 bottom
BT3  BH-18650-B1BA002  [BATTERY-SMD_18650-1S-L77.1-W20.7-1]  60.22 44.98 180 bottom
C1  100nF  [C0603]  42.16 79.37 0 top
C2  100nF  [C0603]  32.26 65.14 270 top
C3  10uF  [C0603]  30.9 60.95 90 top
C4  10uF  [C0603]  32.93 60.95 90 top
C5  10uF  [C0603]  34.84 60.95 90 top
C6  22uF  [C0603]  26.35 76.52 0 top
C7  22uF  [C0603]  26.39 74.47 0 top
C9  100nF  [C0603]  26.29 78.98 180 top
C10  10uF  [C0603]  12.76 59.88 90 top
C11  10uF  [C0603]  14.66 59.95 90 top
C12  10uF  [C0603]  16.56 59.95 90 top
C13  22uF  [C0603]  5.42 76.38 0 top
C14  22uF  [C0603]  5.42 74.37 0 top
C15  100nF  [C0603]  10.69 64.48 270 top
C16  100nF  [C0603]  5.34 78.73 180 top
C17  100nF  [C0603]  6.03 52.76 180 top
C18  100nF  [C0603]  11.5 52.25 0 top
C19  100nF  [C0603]  17.27 52.82 180 top
C20  100nF  [C0603]  70.74 44.85 270 top
C21  1uF  [C0603]  11.81 22.22 0 top
C22  0.1uF  [C0603]  32 23.49 180 top
C23  22uF  [C0603]  32.65 53.8 0 top
C24  2.2nF  [C0603]  38.75 14.94 270 top
C25  2.2nF  [C0603]  33.53 10.73 180 top
C26  100nF  [C0603]  36.46 20.27 0 top
C27  10uF  [C0603]  15.11 27.93 270 top
C28  4.7uF  [C0603]  21.85 22.9 180 top
C29  1uF  [C0603]  27.19 7.07 180 top
C30  100uF  [C0603]  54.23 72.38 90 top
C31  330uH  [C0603]  42.29 74.3 0 top
CN1  ZX-XH2.54-2PWZ  [CONN-TH_2P-P2.50_ZX-XH2.54-2PWZ]  49.15 88.89 0 top
CN2  ZX-XH2.54-2PWZ  [CONN-TH_2P-P2.50_ZX-XH2.54-2PWZ]  27.31 88.76 0 top
CN3  ZX-XH2.54-2PWZ  [CONN-TH_2P-P2.50_ZX-XH2.54-2PWZ]  5.84 88.89 0 top
D1  SS34  [SMC_L6.9-W5.9-LS7.9-RD]  35.95 29.42 0 top
D2  SS34  [SMC_L6.9-W5.9-LS7.9-RD]  22.49 29.8 90 top
H1  PZ254V-11-02P  [HDR-TH_2P-P2.54-V-M]  54.74 86.35 90 top
H2  PZ254V-11-02P  [HDR-TH_2P-P2.54-V-M]  11.45 86.42 90 top
H3  PZ254V-11-02P  [HDR-TH_2P-P2.54-V-M]  32.89 86.22 90 top
H7  PZ254V-11-02P  [HDR-TH_2P-P2.54-V-M]  67.06 3.67 270 top
L1  4.7uH  [IND-SMD_L4.0-W4.0_FNR40XXS]  28.63 70.81 270 top
L2  2.2uH  [IND-SMD_L4.0-W4.0_FNR40XXS]  7.13 70.27 270 top
L3  4.7uH  [IND-SMD_L11.5-W10.0_FXL1040]  32.01 40.85 90 top
L4  330uH  [IND-SMD_L11.5-W10.0_FXL1040]  41.4 63.74 270 top
LED1  -  [LED_0603]  13.53 12.44 270 top
LED2  -  [LED_0603]  26.3 15.58 270 top
LED3  -  [LED_0603]  24.52 15.58 270 top
OLED1  HS91L02W2C01  [OLED-TH_L38.0-W12.0_HS91L02W2C01]  49.02 3.42 90 top
Q1  AO4408-VB  [SO-8_L4.9-W3.9-P1.27-LS5.9-BL]  6.86 36.06 180 top
Q2  AO4408-VB  [SO-8_L4.9-W3.9-P1.27-LS5.9-BL]  13.97 35.93 180 top
R1  10K  [R0603]  28.76 61.05 270 top
R2  10K  [R0603]  25.09 64.29 0 top
R3  54.9K  [R0603]  25.1 62.65 180 top
R4  10K  [R0603]  2.69 62.38 90 top
R6  33.2K  [R0603]  4.47 62.12 270 top
R7  10K  [R0603]  7.24 59.93 270 top
R8  10K  [R0603]  58.55 10.91 180 top
R9  10K  [R0603]  57.28 15.74 0 top
R10  3M  [R0603]  2.43 47.07 90 top
R11  10mΩ  [R0603]  6.31 45.29 270 top
R12  1K  [R0603]  5.97 56.25 180 top
R13  1K  [R0603]  12.06 54.98 270 top
R14  1K  [R0603]  16.51 55.62 270 top
R15  330K  [R0603]  7.08 42.25 0 top
R16  10K  [R0603]  16.37 42.28 180 top
R17  10K  [R0603]  61.98 49.52 90 top
R18  10K  [R0603]  60.07 49.52 90 top
R19  2mΩ  [R0603]  67.31 49.39 0 top
R21  1K  [R0603]  7.75 22.22 0 top
R23  10K  [R0603]  15.31 12.41 90 top
R24  100m  [R0603]  32.01 50.88 90 top
R51  0  [R0603]  32.14 56.72 90 top
R52  750  [R0603]  36.7 16.37 90 top
R53  2.5K  [R0603]  32.78 13.42 90 top
R54  10K  [R0603]  26.3 12.27 90 top
R55  10K  [R0603]  24.52 12.15 90 top
R56  10K  [R0603]  22.61 10.53 270 top
R57  10K  [R0603]  22.61 6.98 270 top
R58  10K  [R0603]  4.92 10.67 180 top
R59  9.1K  [R0603]  42.24 76.83 0 top
R60  1K  [R0603]  46.86 76.83 0 top
SW1  TS-1101-C-W  [SW-SMD_L6.0-W3.3-LS8.0]  66.04 10.28 180 top
SW2  SS12D07VG4 087  [SW-TH_SS12D07VG4]  72.14 76.44 90 top
U1  TPS563201DDCR  [SOT-23-6_L2.9-W1.6-P0.95-LS2.8-BR]  28.63 65.6 90 top
U2  TPS563201DDCR  [SOT-23-6_L2.9-W1.6-P0.95-LS2.8-BR]  7.26 64.48 90 top
U3  STC8G1K08A-36I-SOP8  [SOP-8_L5.0-W4.0-P1.27-LS6.0-BL]  59.06 4.82 270 top
U4  CM1033-DS  [SOP-8_L5.0-W4.0-P1.27-LS6.2-BL]  11.41 45.25 180 top
U5  INA226AIDGSR  [MSOP-10_L3.0-W3.0-P0.50-LS5.0-BL]  66.04 46.47 270 top
U6  CH224K  [ESSOP-10_L4.9-W3.9-P1.0-LS6.0-TL-EP]  9.11 16.37 180 top
U7  MP26123DR-LF-Z  [QFN-16_L4.0-W4.0-P0.65-BL-EP2.2]  31.82 18.29 270 top
U13  LM2596S-12/TR  [TO-263-5_L10.6-W9.6-P1.70-LS15.9-BR]  55.12 64.32 180 top
U14  1N5822/SMD2.8*4.5  [DO-214AC_L4.3-W2.7-LS5.0-RD]  49.4 53.46 0 top
U24  -  [JLC-QRCODE-5x5]  44.2 47.36 0 top
USB1  TYPE-C 6P(073)  [TYPE-C-SMD_TYPE-C-6P_5]  5.91 3.8 0 top

## Footprints (pads in the part's own frame, mm; a bottom-side part is the same pattern mirrored in y, then rotated)
BATTERY-SMD_18650-1S-L77.1-W20.7-1
  rect 7.62x5.08 smd: 1(0,-41.313) 2(0,41.313)
C0603
  rect 0.8x0.9 smd: 1(-0.7,0) 2(0.7,0)
CONN-TH_2P-P2.50_ZX-XH2.54-2PWZ
  rect 1.524x1.5 hole 0.9: 1(-1.25,0)
  round 1.5 hole 0.9: 2(1.25,0)
DO-214AC_L4.3-W2.7-LS5.0-RD
  rect 2.07x2.06 smd: 1(-1.929,0) 2(1.929,0)
ESSOP-10_L4.9-W3.9-P1.0-LS6.0-TL-EP
  rect 0.6x1.5 smd: 1(-2,-3) 2(-1,-3) 3(0,-3) 4(1,-3) 5(2,-3) 6(2,3) 7(1,3) 8(0,3) 9(-1,3) 10(-2,3)
  rect 3.3x2.1 smd: 11(0,0)
HDR-TH_2P-P2.54-V-M
  rect 2x2 hole 1.2: 1(-1.27,0)
  round 2 hole 1.2: 2(1.27,0)
IND-SMD_L4.0-W4.0_FNR40XXS
  rect 1.6x3.9 smd: 1(-1.5,0) 2(1.5,0)
IND-SMD_L11.5-W10.0_FXL1040
  rect 4.1x4.1 smd: 1(-4.75,0) 2(4.75,0)
LED_0603
  rect 0.8x0.8 smd: 1(-0.851,-0.01) 2(0.75,-0.005)
MSOP-10_L3.0-W3.0-P0.50-LS5.0-BL
  oval 0.28x1.62 smd: 1(-1,-2.11) 2(-0.5,-2.11) 3(0,-2.11) 4(0.5,-2.11) 5(1,-2.11) 6(1,2.11) 7(0.5,2.11) 8(0,2.11) 9(-0.5,2.11) 10(-1,2.11)
OLED-TH_L38.0-W12.0_HS91L02W2C01
  round 1.6 hole 1: 1(0,-3.81) 2(0,-1.27) 3(0,1.27) 4(0,3.81)
QFN-16_L4.0-W4.0-P0.65-BL-EP2.2
  oval 0.35x1 smd: 1(-0.965,-1.9) 2(-0.315,-1.9) 3(0.336,-1.9) 4(0.986,-1.9) 9(0.991,1.9) 10(0.341,1.9) 11(-0.31,1.9) 12(-0.96,1.9)
  oval 1x0.35 smd: 5(1.9,-0.991) 6(1.9,-0.341) 7(1.9,0.31) 8(1.9,0.96) 13(-1.9,0.96) 14(-1.9,0.31) 15(-1.9,-0.341) 16(-1.9,-0.991)
  rect 2.2x2.2 smd: 17(0,0)
R0603
  rect 0.806x0.864 smd: 1(-0.753,0) 2(0.753,0)
SMC_L6.9-W5.9-LS7.9-RD
  rect 2.7x3.3 smd: 1(-3.687,0) 2(3.687,0)
SO-8_L4.9-W3.9-P1.27-LS5.9-BL
  oval 0.574x1.888 smd: 1(-1.905,-2.699) 2(-0.635,-2.699) 3(0.635,-2.699) 4(1.905,-2.699) 5(1.905,2.699) 6(0.635,2.699) 7(-0.635,2.699) 8(-1.905,2.699)
SOP-8_L5.0-W4.0-P1.27-LS6.0-BL
  oval 0.574x2.035 smd: 1(-1.905,-2.768) 2(-0.635,-2.768) 3(0.635,-2.768) 4(1.905,-2.768) 5(1.905,2.768) 6(0.635,2.768) 7(-0.635,2.768) 8(-1.905,2.768)
SOP-8_L5.0-W4.0-P1.27-LS6.2-BL
  oval 0.7x1.7 smd: 1(-1.905,-2.9) 2(-0.635,-2.9) 3(0.635,-2.9) 4(1.905,-2.9) 5(1.905,2.9) 6(0.635,2.9) 7(-0.635,2.9) 8(-1.905,2.9)
SOT-23-6_L2.9-W1.6-P0.95-LS2.8-BR
  rect 1.1x0.6 smd: 1(1.35,-0.95) 2(1.35,0) 3(1.35,0.95) 4(-1.35,0.95) 5(-1.35,0) 6(-1.35,-0.95)
SW-SMD_L6.0-W3.3-LS8.0
  rect 1.9x1.5 smd: 1(-4,0) 2(4,0)
SW-TH_SS12D07VG4
  oval 1.6x1.6 hole 1: 1(-2,0) 2(0,0) 3(2,0)
  oval 2x3 hole 1x1.8: 4(4.15,0) 5(-4.15,0)
TO-263-5_L10.6-W9.6-P1.70-LS15.9-BR
  rect 3.358x1.02 smd: 1(5.184,-3.4) 2(5.184,-1.7) 3(5.184,0) 4(5.184,1.7) 5(5.184,3.4)
  rect 7.83x10.431 smd: 6(-5.184,0)
TYPE-C-SMD_TYPE-C-6P_5
  oval 1.1x1.7 hole 0.7x1.2: 7(-4.32,1.775) 7(-4.32,-2.025) 7(4.32,1.775) 7(4.32,-2.025)
  rect 0.7x1.2 smd: A5(-0.5,2.025) A9(1.5,2.025) B5(0.5,2.025) B9(-1.5,2.025)
  rect 0.8x1.2 smd: A12(2.7,2.025) B12(-2.7,2.025)

## Nets
As in the schematic.

Pads without a net: SW2 3 4 5; U6 2 3 9; U7 7

## Via types
v1: diameter 0.61, hole 0.305, Top Layer to Bottom Layer, 263 vias

## Routing (per net, layer and track width the routed paths; a pad name or vN(x,y) marks a point on that pad's centre or on a via; arc(x,y) is an arc through that point)
+3.3V: length 130.3
  Top Layer w0.254: v1(72.14,45.71) 70.9,45.71 C20.1 70.66,45.47 U5.6
  Top Layer w0.3: L2.1 3.7,71.77 v1(3.68,71.75) ; v1(5.84,61.2) 4.62,61.2 R6.2
  Bottom Layer w0.254: v1(72.14,45.71) 74.68,48.25 74.68,84.06 68.96,89.78 50.97,89.78 50.82,89.92 25.3,89.92 25.16,89.78 7.98,89.78 CN3.2
  Bottom Layer w0.3: v1(3.68,71.75) 3.68,65.27 5.84,63.11 v1(5.84,61.2)
+5V: length 102.8
  Top Layer w0.254: R8.2 57.79,12.56 56.52,13.83 R9.1
  Top Layer w0.3: R3.2 24.3,62.6 v1(22.99,62.6) ; L1.1 v1(22.99,72.31)
  Top Layer w0.8: 51.97,5.45 50.29,3.77 OLED1.2 ; 51.97,5.45 U3.2 ; 51.97,5.45 51.97,12.46 55.25,15.74 R9.1 56.52,19.03 v1(56.51,19.04)
  Bottom Layer w0.8: v1(22.99,72.31) v1(22.99,62.6) 22.99,52.57 v1(56.51,19.04)
GND: length 82.2
  Top Layer w0.254: v1(20.57,21.2) 21.15,21.78 C28.2 ; C3.2 C4.2 C5.2 34.93,61.74 v1(34.93,63.87) ; U14.2 54.32,53.46 v1(55.6,54.74) ; Q1.5 Q1.6 Q1.8 11.94,33.36 Q2.5 Q2.6 Q2.7 Q2.8 ; v1(55.36,81.68) 54.74,82.3 54.74,85.08 ; v1(53.94,75.8) 54.23,75.51 C30.2 ; v1(47.37,60.82) 47.47,60.92 U13.5 ; R2.1 24.26,64.37 v1(24.26,65.9) ; v1(18.41,60.82) 16.74,60.82 C12.2 C11.2 12.82,60.65 C10.2 ; v1(31.75,68.7) 30,66.95 U1.1 ; Q2.3 Q2.2 Q2.1 ; v1(36.58,22.34) 37.16,21.76 C26.2 ; R17.2 R18.2 60.07,53.16 v1(58.51,54.73) ; v1(45.21,89.27) 47.52,89.27 CN1.1 ; 60.13,64.45 60.13,71.05 v1(59.94,71.24) ; C31.2 43.31,74.3 v1(44.18,73.43) ; v1(47.12,64.25) 49.44,64.25 49.63,64.45 ; R4.1 2.69,60.64 v1(2.25,60.2) ; U7.17 31.82,17.05 31.67,16.9 31.67,16.59 U7.6 31.5,16.37 v1(31.5,15.1) ; D1.2 40.64,28.42 v1(40.64,26.28) ; C20.2 70.74,42.81 v1(70.24,42.31) ; v1(69.72,47.36) 69.72,46.55 69.22,46.04 68.22,46.04 U5.7
  vias: v1(1.14,57.54) v1(1.14,56.51) v1(1.38,80.16) v1(1.38,78.73) v1(1.38,77.25) v1(1.4,75.94) v1(1.39,74.51) v1(1.39,73.03) v1(1.53,11.83) v1(1.52,10.4) v1(1.52,8.92) v1(2.16,50.69) v1(2.16,49.65) v1(2.41,80.16) v1(2.41,78.73) v1(2.4,77.25) v1(2.43,75.94) v1(2.43,74.51) v1(2.42,73.03) v1(2.56,11.83) v1(2.56,10.4) v1(2.55,8.92) v1(3.13,60.19) v1(3.64,50.67) v1(3.64,49.65) v1(3.81,48.54) v1(3.81,47.5) v1(5.13,31.4) v1(5.13,30.37) v1(5.29,48.52) v1(5.29,47.5) v1(6.56,31.4) v1(6.56,30.36) v1(8.04,31.39) v1(8.04,30.36) v1(9.75,26.3) v1(9.75,25.27) v1(9.66,10.56) v1(9.65,9.13) v1(9.65,7.65) v1(10.69,10.56) v1(10.69,9.13) v1(10.68,7.65) v1(11.18,26.3) v1(11.18,25.26) v1(11.31,5.48) v1(11.3,4.05) v1(11.3,2.57) v1(11.54,81.17) v1(11.53,79.75) v1(11.53,78.26) v1(12.29,31.38) v1(12.29,30.35) v1(12.34,5.48) v1(12.34,4.05) v1(12.33,2.57) v1(12.57,81.17) v1(12.57,79.75) v1(12.56,78.26) v1(12.66,26.29) v1(12.66,25.26) v1(13.72,31.38) v1(13.72,30.34) v1(14.23,23.39) v1(14.22,21.96) v1(14.22,20.48) v1(14.73,44.97) v1(14.73,43.93) v1(15.2,31.37) v1(15.2,30.34) v1(15.26,23.39) v1(15.26,21.96) v1(15.25,20.48) v1(16.22,44.96) v1(16.22,43.93) v1(17.5,40.14) v1(17.5,39.12) v1(18.17,37.99) v1(18.16,36.57) v1(18.16,35.08) v1(18.92,40.14) v1(18.92,39.11) v1(19.2,37.99) v1(19.2,36.57) v1(19.19,35.08) v1(20.41,40.13) v1(20.41,39.11) v1(21.59,21.2) v1(22.23,4.47) v1(22.22,3.04) v1(22.22,1.56) v1(22.97,79.4) v1(22.97,77.97) v1(22.97,76.49) v1(22.99,74.29) v1(23.26,4.47) v1(23.26,3.04) v1(23.25,1.56) v1(24,79.4) v1(24,77.97) v1(23.99,76.49) v1(24.01,74.29) v1(27.82,5.23) v1(27.81,3.8) v1(27.81,2.32) v1(28.84,2.32) v1(28.85,5.23) v1(28.85,3.8) v1(31.09,7.76) v1(31.09,6.73) v1(31.75,69.71) v1(32.51,7.76) v1(32.51,6.72) v1(32.77,69.71) v1(32.77,68.7) v1(34.02,81.94) v1(34.01,80.51) v1(34.01,79.03) v1(34,7.75) v1(34,6.72) v1(34.39,13.35) v1(34.39,12.32) v1(35.04,79.03) v1(35.05,81.94) v1(35.05,80.51) v1(35.81,13.35) v1(35.81,12.31) v1(37.3,13.34) v1(37.3,12.31) v1(40.64,25.26) v1(41.28,15.9) v1(41.28,14.47) v1(41.28,12.99) v1(41.53,26.28) v1(41.53,25.26) v1(42.29,26.28) v1(42.29,25.26) v1(42.31,15.9) v1(42.31,14.47) v1(42.3,12.99) v1(43.81,89.27) v1(43.81,88) v1(44.17,72) v1(44.17,70.52) v1(44.97,8.4) v1(44.96,6.98) v1(44.96,5.49) v1(45.21,88) v1(45.21,73.43) v1(45.21,72) v1(45.2,70.52) v1(46,8.4) v1(46,6.98) v1(45.99,5.49) v1(46.32,80.38) v1(46.32,79.35) v1(47.51,8.4) v1(47.5,6.98) v1(47.5,5.49) v1(47.75,80.38) v1(47.75,79.34) v1(48.54,8.4) v1(48.54,6.98) v1(48.53,5.49) v1(49.24,80.37) v1(49.24,79.34) v1(49.39,76.86) v1(49.38,75.43) v1(49.38,73.95) v1(50.42,76.86) v1(50.42,75.43) v1(50.41,73.95) v1(53.94,76.83) v1(55.35,80.25) v1(55.35,78.77) v1(55.37,76.83) v1(55.37,75.79) v1(55.6,55.77) v1(56.39,81.68) v1(56.39,80.25) v1(56.38,78.77) v1(56.85,76.81) v1(56.85,75.79) v1(57.02,55.77) v1(57.02,54.73) v1(57.28,71.24) v1(58.42,73.52) v1(58.46,72.28) v1(58.46,71.24) v1(58.51,55.75) v1(59.9,73.52) v1(59.9,72.49) v1(61.09,73.27) v1(61.13,72.28) v1(61.13,71.24) v1(62.57,73.27) v1(62.57,72.23) v1(62.61,71.24) v1(70.11,19.45) v1(70.1,18.02) v1(70.1,16.54) v1(70.11,15.13) v1(70.1,13.71) v1(70.1,12.22) v1(70.23,40.88) v1(70.23,39.4) v1(70.63,4.19) v1(70.63,2.77) v1(70.63,1.28) v1(71.14,19.45) v1(71.14,18.02) v1(71.13,16.54) v1(71.14,15.13) v1(71.14,13.71) v1(71.13,12.22) v1(71.27,42.31) v1(71.27,40.88) v1(71.26,39.4) v1(71.66,4.19) v1(71.66,2.77) v1(71.65,1.28)
VBAT: length 120.4
  Top Layer w0.254: U5.8 U5.9
  Top Layer w0.7: R19.1 66.58,49.37 66.58,47.44 67.28,46.74 68.15,46.74
  Top Layer w0.75: C4.1 C3.1 28.81,60.25 R1.2 22.46,60.29 21.97,59.81 ; C4.1 C5.1 34.9,60.32 36.96,60.32 38.59,61.94 38.59,63.59 39.12,64.13 43.43,64.13 47.03,67.72 U13.1 50.29,68.08 50.29,70.35 51.62,71.68 C30.1 54.46,71.45 54.46,58.43 54.99,57.9 58.55,57.9 66.56,49.89 R19.1 ; C4.1 32.93,58.27 R51.2 ; R7.2 2.02,59.18 1.02,60.19 1.02,64.63 2.22,65.83 U2.3 ; U1.3 27.65,66.92 23.11,66.92 21.97,65.78 21.97,59.81 ; 21.97,59.81 21.84,59.81 21.28,59.25 C12.1 C11.1 12.82,59.25 C10.1 7.24,59.18
VBAT+5V: length 82
  Top Layer w0.254: v1(40.26,55.36) 39.5,56.12 v1(36.58,56.12) ; R14.1 16.72,56.16 29,56.16 v1(29.08,56.24)
  Bottom Layer w0.254: v1(29.08,56.24) 29.2,56.12 v1(36.58,56.12) ; 65.57,76.44 65.57,68.99 51.94,55.36 v1(40.26,55.36)
  Bottom Layer w0.8: BT3.2 60.22,80.49 64.26,76.44 SW2.2
VBUS: length 67.9
  Top Layer w0.762: 7.41,5.83 7.52,5.72 7.52,4.21 6.98,3.67 4.95,3.67 4.41,4.22 4.41,10.43 R58.2 4.17,19.39 R21.1
  Top Layer w0.8: 29.69,19.48 29.37,19.8 19.69,19.8 18.67,20.82 18.67,27.15 17.19,28.63 ; 17.19,28.63 17.64,28.63 D2.2 ; 17.19,28.63 C27.1 7.81,28.63 6.99,27.81 R21.1
ALERT: length 45.8
  Top Layer w0.254: U3.7 63.12,5.45 66.68,9.01 66.68,45.2 65.41,46.47 U5.3
SCL: length 76.3
  Top Layer w0.254: U5.5 64.25,45.47 64.39,45.33 64.39,21.45 ; U3.1 56.29,12.34 v1(56.51,12.56) ; OLED1.3 49.78,5.45 49.78,17.9 53.47,21.58 64.26,21.58 64.39,21.45 ; 64.39,21.45 64.39,18.15 61.98,15.74 R9.2 58.04,15.73 v1(58.04,14.09)
  Bottom Layer w0.254: v1(56.51,12.56) v1(58.04,14.09)
SDA: length 72.4
  Top Layer w0.254: R8.1 59.3,11.03 65.66,17.39 65.66,45.21 64.9,45.97 U5.4 ; R8.1 60.07,10.91 60.45,10.53 60.45,4.44 57.4,1.39 47.24,1.39 OLED1.4 ; R8.1 59.31,10.9 59.31,6.09 57.4,4.18 U3.3
$1N480: length 3.6
  Top Layer w0.254: 29.58,64.25 29.71,64.38 31.88,64.38 32,64.25 32.26,64.25 32.44,64.43 32.44,64.69 32.26,64.51 C2.2
$1N907: length 2.5
  Top Layer w0.254: R1.1 28.76,64.13 28.63,64.25
$1N1663: length 6.9
  Top Layer w0.254: L1.2 U1.2 28.63,66.1 28.83,65.9 30.35,65.9 30.41,65.84 C2.1
$1N2394: length 7.6
  Top Layer w0.254: C15.1 10.14,64.63 7.62,64.63 7.26,64.99 U2.2 7.13,65.96 L2.2
$1N2430: length 2.7
  Top Layer w0.254: U2.6 10.04,63.13 C15.2
$1N2495: length 4.1
  Top Layer w0.254: R4.2 2.95,62.87 R6.1 6.26,62.87 6.31,62.82 U2.4
$1N2733: length 3.5
  Top Layer w0.254: 27.69,64.25 27.65,64.29 R2.2 25.84,62.65 R3.1
$1N2737: length 2.5
  Top Layer w0.254: U2.5 7.24,63.11 R7.1
$1N3211: length 3.6
  Top Layer w0.254: SW1.2 61.82,10.06 U3.8
$1N3646: length 5.4
  Top Layer w0.254: H7.2 66.55,2.91 U3.5
$1N3651: length 5.5
  Top Layer w0.254: H7.1 66.29,4.18 U3.6
$1N4805: length 135.6
  Top Layer w0.762: v1(19.18,64.25) 13.84,64.25 v1(13.72,64.13) ; v1(13.72,56) 12.33,56 R13.1
  Bottom Layer w0.762: v1(19.18,64.25) 19.18,72.38 22.35,75.56 38.37,75.56 ; 38.37,75.56 38.37,46.2 60.22,24.36 BT3.1 ; 38.37,75.56 BT2.2 ; v1(13.72,64.13) v1(13.72,56)
$1N4809: length 111.7
  Top Layer w0.762: v1(9.4,57.65) 8,56.25 R12.1
  Bottom Layer w0.762: 17.27,68.1 17.27,45.08 38.37,23.97 BT2.1 ; 17.27,68.1 17.27,85.8 BT1.2 ; 17.27,68.1 11.72,68.1 9.4,65.78 v1(9.4,57.65)
$1N4814: length 82.2
  Top Layer w0.254: C19.1 17.97,48.06 16,46.09 10.16,46.09 9.53,46.73 9.53,48.13 U4.4 ; v1(9.65,49.65) 9.65,48.29 U4.4 ; U4.4 6.6,48.15 6.35,47.89 6.35,46.22 ; v1(10.67,50.54) 10.8,50.66 C18.1 7.24,52.25 C17.1 ; R11.1 6.17,46.17 2.43,46.17
  Top Layer w0.3: 6.17,46.17 6.22,46.22 6.35,46.22 6.6,45.96 v1(8.89,45.96)
  Bottom Layer w0.254: v1(10.67,50.54) 9.78,49.65 v1(9.65,49.65)
  Bottom Layer w0.8: BT1.1 16.91,37.94 v1(8.89,45.96)
$1N5216: length 12.4
  Top Layer w0.254: U4.3 10.78,49.41 9.65,50.54 6.22,50.54 5.33,51.43 C17.2 5.33,56.14 R12.2
$1N5255: length 6.2
  Top Layer w0.254: R13.2 12.06,52.38 C18.2 12.19,48.29 U4.2
$1N5318: length 9.3
  Top Layer w0.254: R14.2 16.58,54.8 16.58,49.33 15.39,48.15 U4.1
$1N5612: length 1.7
  Top Layer w0.254: R15.2 7.92,42.34 U4.5
$1N5633: length 8.4
  Top Layer w0.254: 6.31,44.53 6.32,44.52 R15.1 6.32,38.86 Q1.3 Q1.1
$1N5753: length 12.6
  Top Layer w0.254: U4.6 10.78,37.82 9.78,36.82 5.21,36.82 4.95,37.07 Q1.4
$1N5763: length 3.7
  Top Layer w0.254: Q2.4 12.06,42.33 U4.7
$1N5768: length 2.3
  Top Layer w0.254: U4.8 15.55,42.34 R16.2
$1N6297: length 2.9
  Top Layer w0.254: R17.1 61.98,48 62.23,47.74 63.66,47.74 U5.1
$1N6302: length 5.5
  Top Layer w0.254: U5.2 60.33,46.97 60.07,47.23 R18.1
$1N6419: length 29.7
  Top Layer w0.7: SW2.1 70.01,74.44 68.2,72.63 68.2,49.53 R19.2 68.2,49.26 68.2,47.81 68.15,47.76
$1N6945: length 1
  Top Layer w0.254: U6.5 U6.4
$1N7077: length 15.6
  Top Layer w0.254: R21.2 C21.1 11.11,19.38 U6.1 14.78,19.37 15.24,18.91 15.24,13.23 R23.2
$1N7476: length 2.4
  Top Layer w0.254: U6.10 13.44,13.37 LED1.1
$1N7478: length 1.8
  Top Layer w0.254: 13.53,11.69 15.27,11.69 R23.1
$1N7673: length 16.2
  Top Layer w0.3: 31.5,21.58 31.5,20.21 U7.15
  Top Layer w0.8: 31.5,21.58 31.5,23.29 ; C22.2 31.3,28.46 32.26,29.42 32.26,35.85 L3.1
$1N7677: length 3.5
  Top Layer w0.254: U7.14 32.13,20.81 32.7,21.39 C22.1
$1N7885: length 55
  Top Layer w0.254: 32.01,51.63 32.1,51.55 33.78,51.55 37.97,47.36 37.97,42.15 45.34,34.79 45.34,20.06 43.33,18.04 34.6,18.04 34.5,17.95 33.72,17.95
  Top Layer w0.8: R51.1 32.14,53.99 C23.1 32.01,53.74 32.01,51.63
$1N8045: length 3.1
  Top Layer w0.254: 33.72,17.3 36.53,17.3 R52.2
$1N8238: length 2.2
  Top Layer w0.254: U7.8 32.78,14.17
$1N8288: length 2
  Top Layer w0.254: R53.1 32.78,10.79 C25.2
$1N8361: length 3
  Top Layer w0.254: U7.13 35.67,20.19 C26.1
$1N8485: length 12.7
  Top Layer w0.8: 30.6,20.41 30.48,20.54 30.48,21.67 29.43,22.72 22.73,22.72 ; D2.1 22.49,22.96 C28.1
$1N8636: length 17.1
  Top Layer w0.254: R54.1 26.3,7.25 C29.2 ; R54.1 29.69,11.52 30.83,12.66 30.83,16.39 ; R54.1 26.17,11.39 R55.1 24.41,11.28 R56.1
$1N8748: length 1.8
  Top Layer w0.254: 26.3,13.03 26.3,14.82 LED2.2
$1N8803: length 4.1
  Top Layer w0.254: U7.4 29.83,17.39 27.25,17.39 26.29,16.43
$1N8881: length 1.9
  Top Layer w0.254: LED3.2 24.52,14.82 R55.2
$1N8936: length 6.7
  Top Layer w0.254: U7.3 24.95,17.95 24.51,17.52 LED3.1
$1N8991: length 19.6
  Top Layer w0.254: R57.1 R56.2 21.84,9.78 20.45,11.17 20.45,15.1 23.95,18.6 U7.2
$1N9197: length 46.4
  Top Layer w0.254: 33.72,18.6 42.74,18.6 44.45,20.31 44.45,33.16 L3.2
  Top Layer w0.8: L3.2 R24.1
$1N9446: length 9.3
  Top Layer w0.254: 5.41,5.83 5.59,6.01 5.59,8.25 6.35,9.01 7.49,9.01 8.11,9.62 U6.7
$1N9462: length 7.8
  Top Layer w0.254: v1(6.98,8.12) 6.41,7.54 6.41,5.83 ; v1(6.98,9.9) 6.98,13.25 U6.6
  Bottom Layer w0.254: v1(6.98,8.12) v1(6.98,9.9)
$1N9510: length 8.3
  Top Layer w0.254: R58.1 5.68,14.05 6.35,14.72 8.89,14.72 9.11,14.51 U6.8
$1N10062: length 2.1
  Top Layer w0.254: R52.1 38.73,15.62 C24.1
$1N12058: length 31.8
  Top Layer w0.254: U14.1 42.93,53.46 41.47,54.92 41.47,58.93
  Top Layer w1: L4.2 41.66,58.74 51.51,58.74 52.96,60.19 52.96,65.52 52.59,65.89 49.89,65.89 49.63,66.15
$1N12301: length 20.8
  Top Layer w0.254: v1(46.11,62.73) 49.62,62.73 49.63,62.75 ; R59.2 46.1,76.83 R60.1 v1(46.11,68.57)
  Bottom Layer w0.254: v1(46.11,68.57) v1(46.11,62.73)

## Copper pours and planes (outline as drawn; the poured copper is in the pictures)
12V on Top Layer: 43.43,66.41 43.43,70.6 42.22,70.6 42.22,80.2 44.56,82.54 51.94,82.54 51.94,86.41 55.75,86.41 55.75,89.98 49.6,89.98 49.4,89.78 49.4,85.82 43.95,85.82 43.67,85.54 43.67,83.92 42.04,82.29 40.77,82.29 40.77,70.98 40.39,70.6 39.29,70.6 39.29,66.49 39.37,66.41
+3.3V on Top Layer: 9.03,71 5.08,71.01 5.08,72.76 5.72,73.4 5.72,88.76 6.98,90.03 12.57,90.03 12.79,89.81 12.79,87.02 12.19,86.42 8.95,86.42
+5V on Top Layer: 26.67,71.49 26.67,85.33 27.81,86.48 27.81,90.36 33.46,90.36 34.16,89.65 34.16,86.73 34.04,86.6 31,86.6 30.61,86.22 30.61,71.49
GND on Top Layer: -3.95,96.46 79.24,96.46 79.24,-3.87 -3.95,-3.87
GND on Bottom Layer: -7.72,99.48 86.9,99.48 86.9,-6.06 -7.72,-6.06

Small or netless copper shapes (teardrops, artwork), in the pictures only: 224 on Top Layer, 15 on Bottom Layer

## Text on the board
Top Silkscreen Layer: 钟栩
